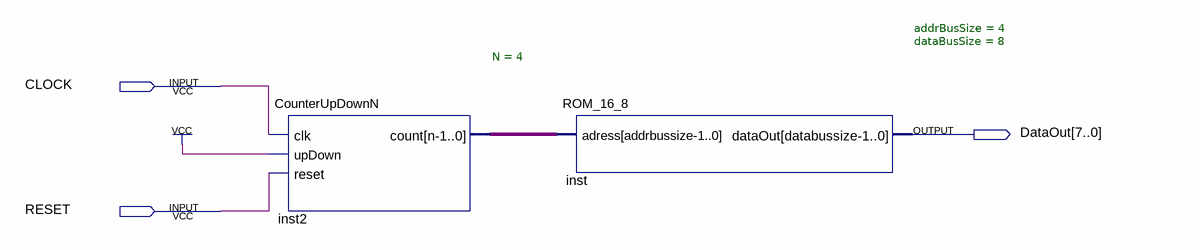
[diagram p0: schematic sheet]
// Quartus schematic ROM_Demo.bdf as structural Verilog: 2 symbols, 3 pins
module ROM_Demo (
  input  CLOCK,
  input  RESET,
  output [7:0] DataOut
);

  wire [3:0] inst2_count;

  CounterUpDownN #(.N(4)) inst2 (.clk(CLOCK), .upDown(1'b1), .reset(RESET), .count(inst2_count));
  ROM_16_8 #(.addrBusSize(4), .dataBusSize(8)) inst (.adress(inst2_count), .dataOut(DataOut));
endmodule
